# Altium schematic sheet ZIGBEE.SchDoc
size A4
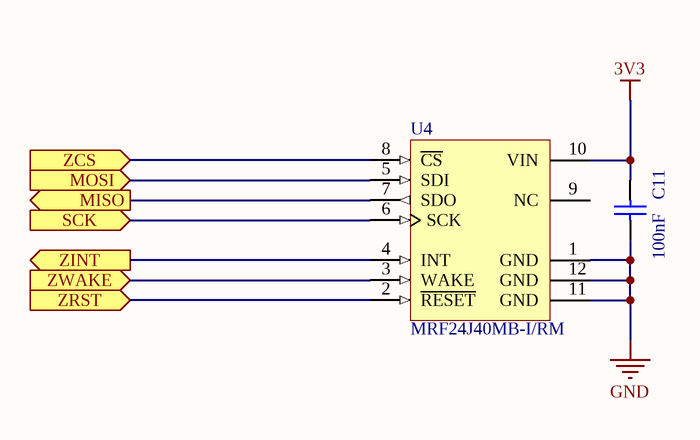
[diagram p0: ZIGBEE.SchDoc]

## Parts
C11  value 100nF  [RESC2012L]  (hidden comment: CAP0603-)
U4  MRF24J40MB-I/RM  [MRF24J40MB]

## Ports
MISO (out), MOSI (in), SCK (in), ZCS (in), ZINT (out), ZRST (in), ZWAKE (in)

## Nets
3V3: C11.2 U4.10(VIN)
GND: C11.1 U4.1(GND) U4.11(GND) U4.12(GND)
MISO: U4.7(SDO) ; port MISO
MOSI: U4.5(SDI) ; port MOSI
SCK: U4.6(SCK) ; port SCK
ZCS: U4.8(~{CS}) ; port ZCS
ZINT: U4.4(INT) ; port ZINT
ZRST: U4.2(~{RESET}) ; port ZRST
ZWAKE: U4.3(WAKE) ; port ZWAKE

Not connected (* = marked no-connect by the designer): U4 9(NC)

## Library data of the parts
C11 = Cap Semi: Capacitor (Semiconductor SIM Model); Published: 8-Jun-2000; LatestRevisionDate: 29-May-2009; LatestRevisionNote: IPC-7351 Footprint Added.; PackageReference: C1206; Publisher: Altium Limited; PackageDescription: Chip Capacitor
U4 = MRF24J40MB-I/RM: 2.4 GHz IEEE Std. 802.15.4, 20 dBm RF Transceiver 12-Pin Module, Industrial Temperature; FirstPublished: 2-Dec-2009; DatasheetVersion: revB, Aug-2009; PackageVersion: Aug-2009; PackageReference: MRF24J40MB; Publisher: Altium Limited; PackageDescription: Transceiver Module; SM; 12 Leads; Body 1.3 x 0.9 x 0.1" (LxWxH), 0.1" Pitch; Supplier 1: Digi-Key; Supplier Part Number 1: MRF24J40MB-I/RM-ND; Supplier 2: Farnell; Supplier Part Number 2: 1755199; Supplier 3: Newark; Supplier Part Number 3: 14R8960; ComponentLink1Description: Datasheet; ComponentLink1URL: http://ww1.microchip.com/downloads/en/DeviceDoc/70599B.pdf; ComponentLink2Description: Packaging Specification; ComponentLink2URL: http://www.microchip.com/stellent/groups/techpub_sg/documents/packagingspec/en012702.pdf; ComponentLink3Description: Microchip.com Home; ComponentLink3URL: http://www.microchip.com/